# EAGLE design kitchenset19 (EAGLE 6.4)
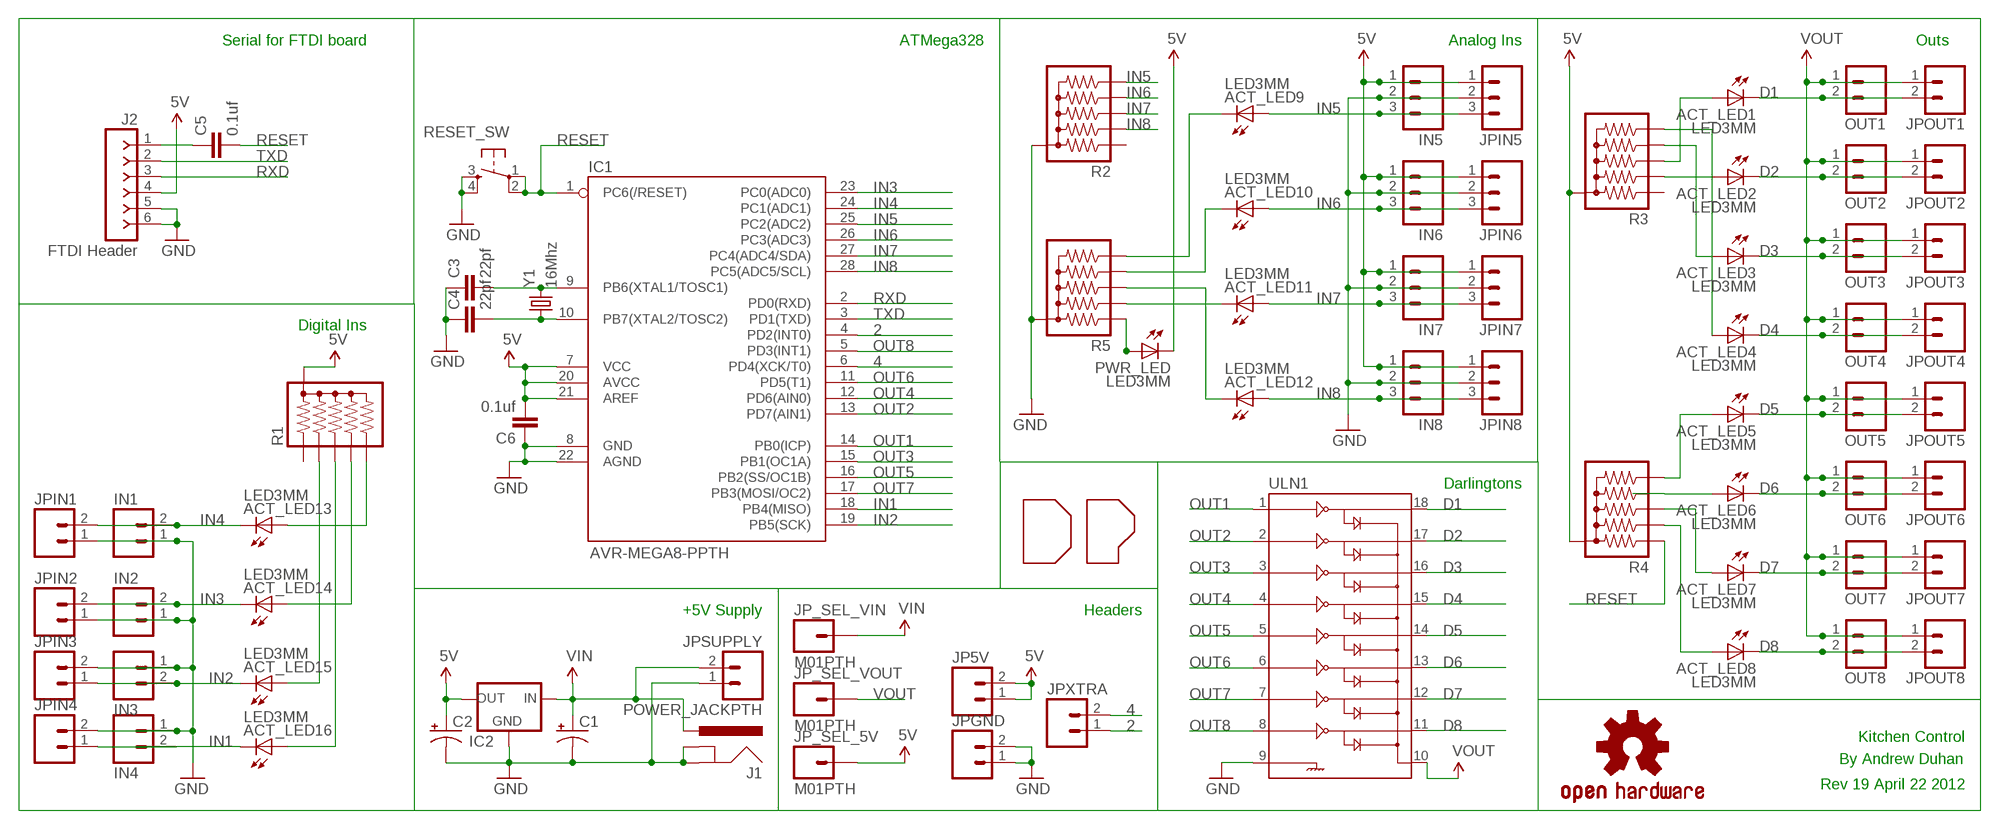
[diagram p0: schematic, sheet 1]

## Parts
ACT_LED1  LED3MM  [LED3MM-POL]
ACT_LED2  LED3MM  [LED3MM-POL]
ACT_LED3  LED3MM  [LED3MM-POL]
ACT_LED4  LED3MM  [LED3MM-POL]
ACT_LED5  LED3MM  [LED3MM-POL]
ACT_LED6  LED3MM  [LED3MM-POL]
ACT_LED7  LED3MM  [LED3MM-POL]
ACT_LED8  LED3MM  [LED3MM-POL]
ACT_LED9  LED3MM  [LED3MM-POL]
ACT_LED10  LED3MM  [LED3MM-POL]
ACT_LED11  LED3MM  [LED3MM-POL]
ACT_LED12  LED3MM  [LED3MM-POL]
ACT_LED13  LED3MM  [LED3MM-POL]
ACT_LED14  LED3MM  [LED3MM-POL]
ACT_LED15  LED3MM  [LED3MM-POL]
ACT_LED16  LED3MM  [LED3MM-POL]
C1  CAP_POLPTH4  [CPOL-RADIAL-1000UF-25V]
C2  CAP_POLPTH4  [CPOL-RADIAL-1000UF-25V]
C3  22pf  CAPPTH  [CAP-PTH-SMALL]
C4  22pf  CAPPTH  [CAP-PTH-SMALL]
C5  0.1uf  CAPPTH  [CAP-PTH-SMALL]
C6  0.1uf  CAPPTH  [CAP-PTH-SMALL]
IC1  AVR-MEGA8-PPTH  [DIL28-3]
IC2  V_REG_78XXSIDE  [78XXL]
IN1  M02JST-PTH-2  [JST-2-PTH]
IN2  M02JST-PTH-2  [JST-2-PTH]
IN3  M02JST-PTH-2  [JST-2-PTH]
IN4  M02JST-PTH-2  [JST-2-PTH]
IN5  M03JST-PTH  [JST-3-PTH]
IN6  M03JST-PTH  [JST-3-PTH]
IN7  M03JST-PTH  [JST-3-PTH]
IN8  M03JST-PTH  [JST-3-PTH]
J1  POWER_JACKPTH  [POWER_JACK_PTH]
J2  FTDI Header  F-1X06-SIP-100-32Y  [SIP-100-06-32Y]
JP5V  M02PTH  [1X02]
JP_SEL_5V  M01PTH  [1X01]
JP_SEL_VIN  M01PTH  [1X01]
JP_SEL_VOUT  M01PTH  [1X01]
JPGND  M02PTH  [1X02]
JPIN1  M02PTH  [1X02]
JPIN2  M02PTH  [1X02]
JPIN3  M02PTH  [1X02]
JPIN4  M02PTH  [1X02]
JPIN5  M03PTH  [1X03]
JPIN6  M03PTH  [1X03]
JPIN7  M03PTH  [1X03]
JPIN8  M03PTH  [1X03]
JPOUT1  M02PTH  [1X02]
JPOUT2  M02PTH  [1X02]
JPOUT3  M02PTH  [1X02]
JPOUT4  M02PTH  [1X02]
JPOUT5  M02PTH  [1X02]
JPOUT6  M02PTH  [1X02]
JPOUT7  M02PTH  [1X02]
JPOUT8  M02PTH  [1X02]
JPSUPPLY  M02PTH4  [1X02_XTRA_BIG]
JPXTRA  M02PTH  [1X02]
OUT1  M02JST-PTH-2  [JST-2-PTH]
OUT2  M02JST-PTH-2  [JST-2-PTH]
OUT3  M02JST-PTH-2  [JST-2-PTH]
OUT4  M02JST-PTH-2  [JST-2-PTH]
OUT5  M02JST-PTH-2  [JST-2-PTH]
OUT6  M02JST-PTH-2  [JST-2-PTH]
OUT7  M02JST-PTH-2  [JST-2-PTH]
OUT8  M02JST-PTH-2  [JST-2-PTH]
PWR_LED  LED3MM  [LED3MM-POL]
R1  RPACK-BUSSED-SIP-PTH-5  [RPACK-SIP-PTH-5]
R2  RPACK-BUSSED-SIP-PTH-5  [RPACK-SIP-PTH-5]
R3  RPACK-BUSSED-SIP-PTH-5  [RPACK-SIP-PTH-5]
R4  RPACK-BUSSED-SIP-PTH-5  [RPACK-SIP-PTH-5]
R5  RPACK-BUSSED-SIP-PTH-5  [RPACK-SIP-PTH-5]
RESET_SW  TAC_SWITCHPTH  [TACTILE-PTH]
U$1  OSHW-LOGOM  [OSHW-LOGO-M]
U$9  DP_LOGO  [DP_LOGO]
ULN1  ULN2803DIP  [DIL18]
Y1  16Mhz  CRYSTALHC49US  [HC49US]

## Nets
2: IC1.4(PD2(INT0)) JPXTRA.1
4: IC1.6(PD4(XCK/T0)) JPXTRA.2
5V: C2.1(+) C6.2 IC1.7(VCC) IC1.20(AVCC) IC1.21(AREF) IC2.OUT IN5.1 IN6.1 IN7.1 IN8.1 J2.4 JP5V.1 JP5V.2 JP_SEL_5V.1 JPIN5.1 JPIN6.1 JPIN7.1 JPIN8.1 PWR_LED.K(C) R1.P$1 R3.P$1 R4.P$1
D1: ACT_LED1.K(C) JPOUT1.2 OUT1.2 ULN1.18
D2: ACT_LED2.K(C) JPOUT2.2 OUT2.2 ULN1.17
D3: ACT_LED3.K(C) JPOUT3.2 OUT3.2 ULN1.16
D4: ACT_LED4.K(C) JPOUT4.2 OUT4.2 ULN1.15
D5: ACT_LED5.K(C) JPOUT5.2 OUT5.2 ULN1.14
D6: ACT_LED6.K(C) JPOUT6.2 OUT6.2 ULN1.13
D7: ACT_LED7.K(C) JPOUT7.2 OUT7.2 ULN1.12
D8: ACT_LED8.K(C) JPOUT8.2 OUT8.2 ULN1.11
DTR: C5.1 J2.1
GND: C1.2(-) C2.2(-) C3.1 C4.1 C6.1 IC1.8(GND) IC1.22(AGND) IC2.GND IN1.1 IN2.1 IN3.1 IN4.1 IN5.2 IN6.2 IN7.2 IN8.2 J1.GND J1.GNDBREAK J2.5 J2.6 JPGND.1 JPGND.2 JPIN1.1 JPIN2.1 JPIN3.2 JPIN4.2 JPIN5.2 JPIN6.2 JPIN7.2 JPIN8.2 JPSUPPLY.1 R2.P$1 R5.P$1 RESET_SW.3 RESET_SW.4 ULN1.9
IN1: ACT_LED16.K(C) IC1.18(PB4(MISO)) IN4.2 JPIN4.1
IN2: ACT_LED15.K(C) IC1.19(PB5(SCK)) IN3.2 JPIN3.1
IN3: ACT_LED14.K(C) IC1.23(PC0(ADC0)) IN2.2 JPIN2.2
IN4: ACT_LED13.K(C) IC1.24(PC1(ADC1)) IN1.2 JPIN1.2
IN5: ACT_LED9.A IC1.25(PC2(ADC2)) IN5.3 JPIN5.3 R2.P$6
IN6: ACT_LED10.A IC1.26(PC3(ADC3)) IN6.3 JPIN6.3 R2.P$5
IN7: ACT_LED11.A IC1.27(PC4(ADC4/SDA)) IN7.3 JPIN7.3 R2.P$4
IN8: ACT_LED12.A IC1.28(PC5(ADC5/SCL)) IN8.3 JPIN8.3 R2.P$3
N$1: ACT_LED9.K(C) R5.P$6
N$2: ACT_LED4.A R3.P$6
N$3: ACT_LED13.A R1.P$6
N$4: C4.2 IC1.10(PB7(XTAL2/TOSC2)) Y1.1
N$5: C3.2 IC1.9(PB6(XTAL1/TOSC1)) Y1.2
N$6: ACT_LED3.A R3.P$5
N$7: ACT_LED2.A R3.P$3
N$8: ACT_LED1.A R3.P$4
N$32: ACT_LED6.A R4.P$5
N$33: ACT_LED8.A R4.P$3
N$34: ACT_LED7.A R4.P$4
N$35: ACT_LED5.A R4.P$6
N$37: ACT_LED14.A R1.P$5
N$38: ACT_LED16.A R1.P$4
N$39: ACT_LED10.K(C) R5.P$5
N$41: ACT_LED12.K(C) R5.P$4
N$42: ACT_LED11.K(C) R5.P$3
N$44: PWR_LED.A R5.P$2
N$45: ACT_LED15.A R1.P$3
OUT1: IC1.14(PB0(ICP)) ULN1.1
OUT2: IC1.13(PD7(AIN1)) ULN1.2
OUT3: IC1.15(PB1(OC1A)) ULN1.3
OUT4: IC1.12(PD6(AIN0)) ULN1.4
OUT5: IC1.16(PB2(SS/OC1B)) ULN1.5
OUT6: IC1.11(PD5(T1)) ULN1.6
OUT7: IC1.17(PB3(MOSI/OC2)) ULN1.7
OUT8: IC1.5(PD3(INT1)) ULN1.8
RESET: C5.2 IC1.1(PC6(/RESET)) R4.P$2 RESET_SW.1 RESET_SW.2
RXD: IC1.2(PD0(RXD)) J2.3
TXD: IC1.3(PD1(TXD)) J2.2
VIN: C1.1(+) IC2.IN J1.PWR JP_SEL_VIN.1 JPSUPPLY.2
VOUT: JP_SEL_VOUT.1 JPOUT1.1 JPOUT2.1 JPOUT3.1 JPOUT4.1 JPOUT5.1 JPOUT6.1 JPOUT7.1 JPOUT8.1 OUT1.1 OUT2.1 OUT3.1 OUT4.1 OUT5.1 OUT6.1 OUT7.1 OUT8.1 ULN1.10
Unconnected: R1.P$2 R2.P$2 R3.P$2

## Notes on the sheet
- Serial for FTDI board | ATMega328 | Analog Ins | Outs
- Digital Ins
- Darlingtons
- +5V Supply | Headers
- Kitchen Control
- By Andrew Duhan
- Rev 19 April 22 2012

## Library data of the parts
ACT_LED1-ACT_LED16 PWR_LED = myparts:LED3MM
C1 C2 = SparkFun-Passives:CAP_POL: Capacitor Polarized These are standard SMD and PTH capacitors. Normally 10uF, 47uF, and 100uF in electrolytic and tantalum varieties. Always verify the external diameter of the through hole cap, it varies with capacity, voltage, and manufacturer. The EIA devices should be standard.
C3-C6 = SparkFun:CAP: Capacitor Standard 0603 ceramic capacitor, and 0.1" leaded capacitor.
IC1 = SparkFun:AVR-MEGA8-P: MICROCONTROLLER 8 Kbytes FLASH 1 kbytes SRAM 512 bytes EEPROM USART 4-channel 10 bit ADC 2-channel 8 bit ADC
IC2 = SparkFun-PowerIC:V_REG_78XX: Voltage Regulator Standard 7805 5V regulator. IGO (Input Ground Output). Spark Fun Electronics SKU : COM-00107
IN1 IN2 JPIN1-JPIN4 JPOUT1-JPOUT8 = SparkFun-Connectors:M02: Header 2 Standard 2-pin 0.1" header. Use with straight break away headers (SKU : PRT-00116), right angle break away headers (PRT-00553), swiss pins (PRT-00743), machine pins (PRT-00117), and female headers (PRT-00115). Molex polarized connector foot print use with SKU : PRT-08233 with associated crimp pins and housings.
IN3 IN4 JP5V JPGND JPSUPPLY JPXTRA OUT1-OUT8 = SparkFun:M02: Header 2 Standard 2-pin 0.1" header. Use with straight break away headers (SKU : PRT-00116), right angle break away headers (PRT-00553), swiss pins (PRT-00743), machine pins (PRT-00117), and female headers (PRT-00115). Molex polarized connector foot print use with SKU : PRT-08233 with associated crimp pins and housings.
IN5-IN8 = SparkFun:M03: Header 3 Standard 3-pin 0.1" header. Use with straight break away headers (SKU : PRT-00116), right angle break away headers (PRT-00553), swiss pins (PRT-00743), machine pins (PRT-00117), and female headers (PRT-00115). Molex polarized connector foot print use with SKU : PRT-08232 with associated crimp pins and housings.
J1 = SparkFun:POWER_JACK: Power Jack This is the standard 5.5mm barrel jack for power. The PTH is the most common, proven, reliable, footprint. All others are experimental. The Slot footprint only works if the mill layer is transmitted to the PCB fab house so be warned. Spark Fun Electronics SKU : PRT-00119. Mating wall wart : TOL-00298 (and others)
J2 = con-headers-jp:F-1X06-: FEMALE HEADER
JP_SEL_5V JP_SEL_VIN JP_SEL_VOUT = SparkFun:M01: Header 1 Standard 1-pin 0.1" header. Use with straight break away headers (SKU : PRT-00116), right angle break away headers (PRT-00553), swiss pins (PRT-00743), machine pins (PRT-00117), and female headers (PRT-00115).
JPIN5-JPIN8 = SparkFun-Connectors:M03: Header 3 Standard 3-pin 0.1" header. Use with straight break away headers (SKU : PRT-00116), right angle break away headers (PRT-00553), swiss pins (PRT-00743), machine pins (PRT-00117), and female headers (PRT-00115). Molex polarized connector foot print use with SKU : PRT-08232 with associated crimp pins and housings.
R1-R5 = SparkFun:RPACK*: BOURNS 4600X series thick-film SIP resistor packs Five resistors bussed to a single pin (denoted by dot). 0.2W / resistor datasheet <http://dlnmh9ip6v2uc.cloudfront.net/datasheets/Components/General/4600x.pdf> SFE parts COM-10855 (330), COM-10856 (10K)
RESET_SW = SparkFun:TAC_SWITCH: Momentary Switch Button commonly used for reset or general input. Spark Fun Electronics SKU : COM-00097
U$1 = SparkFun-Aesthetics:OSHW-LOGO: Open Source Hardware Logo This logo indicates the piece of hardware it is found on incorporates a OSHW license and/or adheres to the definition of open source hardware found here: http://freedomdefined.org/OSHW
U$9 = myparts:DP_LOGO: Duhan Power! logo
ULN1 = SparkFun:ULN2803: Darlington Driver ULN2803 Darlington array. 500mA max per channel, 8-channel package. Spark Fun Electronics SKU : COM-00312
Y1 = SparkFun:CRYSTAL: Crystals Various standard crystals. Proven footprints. Spark Fun Electronics SKU : COM-00534

## Board
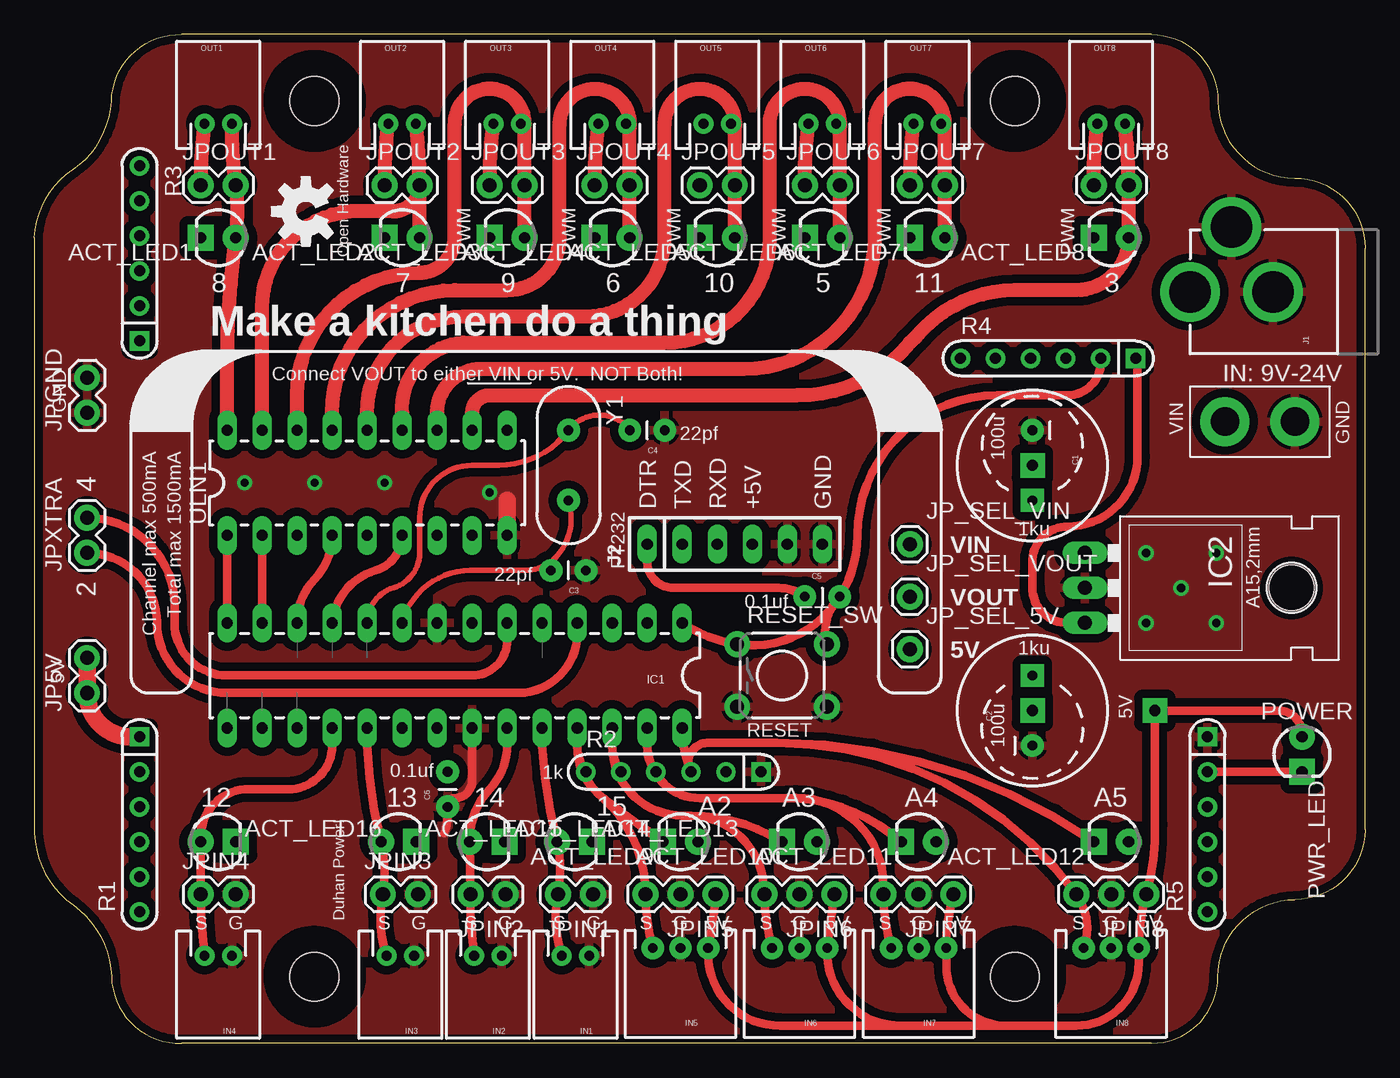
[diagram p1: board, top side]
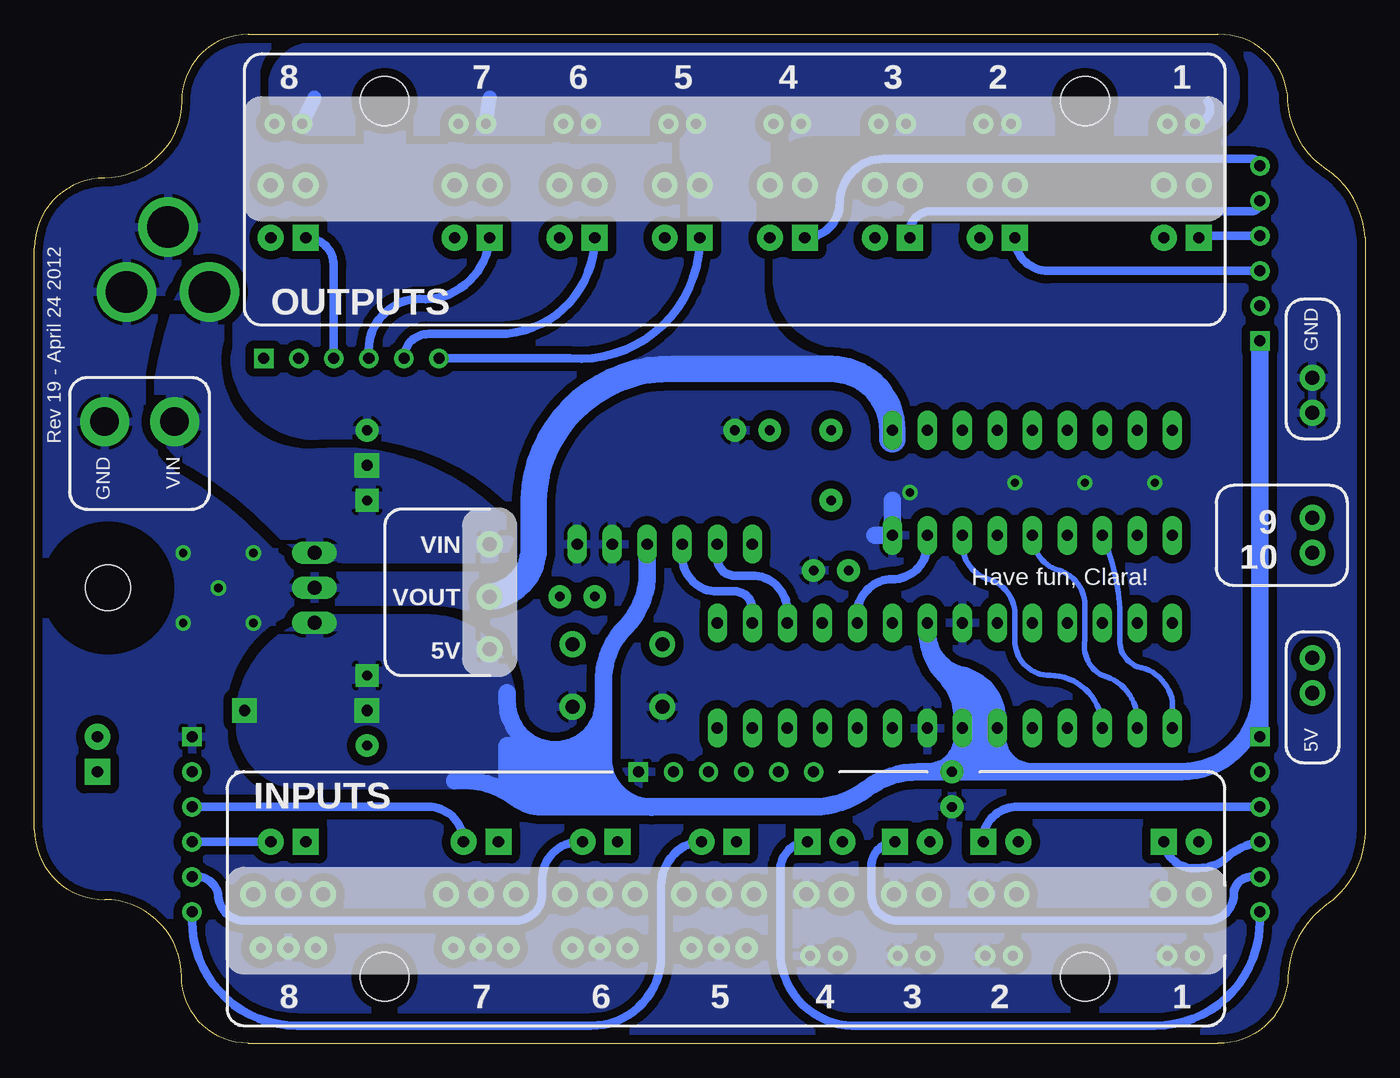
[diagram p2: board, bottom side, seen from below]

Size 96.52 x 73.15 mm. Coordinates in mm from the lower left corner, seen from the top.
Outline: 96.52,15.49 96.52,57.66 arc90 91.44,62.74 arc-90 85.85,68.33 arc90 81.03,73.15 10.67,73.15 arc90 5.59,68.33 arc-53 2.79,63.37 arc53 0,58.42 0,15.24 arc53 2.79,10.03 arc-53 5.59,4.83 arc90 10.67,0 81.03,0 arc90 85.85,4.83 arc-90 91.44,10.41 arc90 96.52,15.49
Copper layers (1*16): Top 0.035mm / dielectric 1.5mm / Bottom 0.035mm
Design rules "default": minimum track width 8mil, minimum drill 20mil, track to track 8mil, track to pad 8mil, pad to pad 8mil, via to via 8mil, smd to smd 8mil, copper to edge 10mil, drill to drill 8mil, minimum pad ring 12mil, minimum via ring 10mil, stop-mask expansion 4mil, vias tented up to drill 25mil, thermal gap 10mil
Holes 3.56 mm at 20.32,4.83 71.12,4.83 71.12,68.33 20.32,68.33
tRestrict: area 17.5,65.5 to 23.1,71.1; area 68.3,65.5 to 73.9,71.1; area 68.3,2 to 73.9,7.6; area 17.5,2 to 23.1,7.6

### Footprints (pad centres in the part's own frame; a part is rotated, then mirrored left to right if it is on the bottom)
LED3MM-POL = drill 0.813 pad 1.88 square: A 1.27,0 | drill 0.813 pad 1.88: K -1.27,0
CPOL-RADIAL-1000UF-25V = drill 0.7 pad 1.651 square: 1 2.54,0 | drill 0.7 pad 1.651: 2 -2.54,0
CAP-PTH-SMALL = drill 0.7 pad 1.651: 1 0,0; 2 2.54,0
DIL28-3 = drill 0.813 long: 1 -16.51,-3.81; 2 -13.97,-3.81; 3 -11.43,-3.81; 4 -8.89,-3.81; 5 -6.35,-3.81; 6 -3.81,-3.81; 7 -1.27,-3.81; 8 1.27,-3.81; 9 3.81,-3.81; 10 6.35,-3.81; 11 8.89,-3.81; 12 11.43,-3.81; 13 13.97,-3.81; 14 16.51,-3.81; 15 16.51,3.81; 16 13.97,3.81; 17 11.43,3.81; 18 8.89,3.81; 19 6.35,3.81; 20 3.81,3.81; 21 1.27,3.81; 22 -1.27,3.81; 23 -3.81,3.81; 24 -6.35,3.81; 25 -8.89,3.81; 26 -11.43,3.81; 27 -13.97,3.81; 28 -16.51,3.81
78XXL = drill 1.016 long: GND 0,-3.81; IN -2.54,-3.81; OUT 2.54,-3.81 | hole 3.302: 0,11.176
JST-2-PTH = drill 0.7 pad 1.448: 1 -1,0; 2 1,0
JST-3-PTH = drill 0.7 pad 1.626: 1 -2,-5; 2 0,-5; 3 2,-5
POWER_JACK_PTH = drill 2.997 pad 4.318: GND 0,7.7; GNDBREAK 4.7,10.7; PWR 0,13.7
SIP-100-06-32Y = drill 0.813 long: 1 -6.35,0; 2 -3.81,0; 3 -1.27,0; 4 1.27,0; 5 3.81,0; 6 6.35,0
1X02 = drill 1.016 pad 1.88: 1 0,0; 2 2.54,0
1X01 = drill 1.016 pad 1.88: 1 0,0
1X03 = drill 1.016 pad 1.88: 1 0,0; 2 2.54,0; 3 5.08,0
1X02_XTRA_BIG = drill 2.057 pad 3.556: 1 -2.54,0; 2 2.54,0
RPACK-SIP-PTH-5 = drill 0.8 square: P$1 0,0 | drill 0.8: P$2 0,-2.54; P$3 0,-5.08; P$4 0,-7.62; P$5 0,-10.16; P$6 0,-12.7
TACTILE-PTH = drill 1.016 pad 1.88: 1 -3.251,2.261; 2 3.251,2.261; 3 -3.251,-2.261; 4 3.251,-2.261
DIL18 = drill 0.813 long: 1 -10.16,-3.81; 2 -7.62,-3.81; 3 -5.08,-3.81; 4 -2.54,-3.81; 5 0,-3.81; 6 2.54,-3.81; 7 5.08,-3.81; 8 7.62,-3.81; 9 10.16,-3.81; 10 10.16,3.81; 11 7.62,3.81; 12 5.08,3.81; 13 2.54,3.81; 14 0,3.81; 15 -2.54,3.81; 16 -5.08,3.81; 17 -7.62,3.81; 18 -10.16,3.81
HC49US = drill 0.7 pad 1.651: 1 -2.54,0; 2 2.54,0

### Placement (x,y rotation side)
ACT_LED1  13.34,58.42 180 top
ACT_LED2  26.67,58.42 180 top
ACT_LED3  34.29,58.42 180 top
ACT_LED4  41.91,58.42 180 top
ACT_LED5  49.53,58.42 180 top
ACT_LED6  57.15,58.42 180 top
ACT_LED7  64.77,58.42 180 top
ACT_LED8  78.11,58.42 180 top
ACT_LED9  46.86,14.61 180 top
ACT_LED10  55.5,14.61 180 top
ACT_LED11  64.14,14.61 180 top
ACT_LED12  78.11,14.61 180 top
ACT_LED13  39.18,14.61 0 top
ACT_LED14  32.83,14.61 0 top
ACT_LED15  26.42,14.61 0 top
ACT_LED16  13.34,14.61 0 top
C1  72.39,41.91 270 top
C2  72.39,24.13 90 top
C3  40.01,34.29 180 top
C4  45.72,44.45 180 top
C5  55.88,32.38 0 top
C6  29.97,17.14 90 top
IC1  30.48,26.67 180 top
IC2  80.01,33.02 270 top
IN1  39.24,6.35 180 top
IN2  32.89,6.35 180 top
IN3  26.54,6.35 180 top
IN4  13.34,6.35 180 top
IN5  46.86,1.91 180 top
IN6  55.5,1.91 180 top
IN7  64.14,1.91 180 top
IN8  78.11,1.91 180 top
J1  97.54,54.48 90 top
J2  50.8,36.2 0 top
JP5V  3.81,25.4 90 top
JP_SEL_5V  63.5,28.57 0 top
JP_SEL_VIN  63.5,36.2 0 top
JP_SEL_VOUT  63.5,32.38 0 top
JPGND  3.81,45.72 90 top
JPIN1  40.51,10.79 180 top
JPIN2  34.16,10.79 180 top
JPIN3  25.27,10.79 0 top
JPIN4  12.06,10.79 0 top
JPIN5  49.4,10.79 180 top
JPIN6  58.04,10.79 180 top
JPIN7  66.67,10.79 180 top
JPIN8  80.64,10.79 180 top
JPOUT1  12.06,62.23 0 top
JPOUT2  25.4,62.23 0 top
JPOUT3  33.02,62.23 0 top
JPOUT4  40.64,62.23 0 top
JPOUT5  48.26,62.23 0 top
JPOUT6  55.88,62.23 0 top
JPOUT7  63.5,62.23 0 top
JPOUT8  76.83,62.23 0 top
JPSUPPLY  88.9,45.09 180 top
JPXTRA  3.81,35.56 90 top
OUT1  13.34,66.67 0 top
OUT2  26.67,66.67 0 top
OUT3  34.29,66.67 0 top
OUT4  41.91,66.67 0 top
OUT5  49.53,66.67 0 top
OUT6  57.15,66.67 0 top
OUT7  64.77,66.67 0 top
OUT8  78.11,66.67 0 top
PWR_LED  91.95,20.95 270 top
R1  7.62,22.23 0 top
R2  52.7,19.68 270 top
R3  7.62,50.93 180 top
R4  79.88,49.66 270 top
R5  85.09,22.23 0 top
RESET_SW  54.23,26.67 0 top
U$1  19.68,60.33 90 top
U$9  19.05,12.7 90 top
ULN1  24.13,40.64 0 top
Y1  38.73,41.91 270 top

### Tracks (layer width: path | path; a pad name or v marks a point on that pad's centre or on a via)
2
  Top 0.61: IC1.4 arc-90 35.56,25.4 13.97,25.4 arc-90 8.89,30.48 arc90 JPXTRA.1
4
  Top 0.61: IC1.6 34.29,29.21 arc-90 31.75,26.67 13.97,26.67 arc-90 10.16,30.48 10.16,31.75 arc90 JPXTRA.2
5V  (via drill 0.8 pad 1.78)
  Top 0.61: 62.87,1.27 54.1,1.27 arc-95 IN5.1 arc9 JPIN5.1 | 70.48,1.27 arc-90 66.14,5.62 IN7.1 arc-16 JPIN7.1 | 70.48,1.27 62.87,1.27 | 62.87,1.27 arc-93 IN6.1 arc-2 JPIN6.1 | 70.48,1.27 75.56,1.27 arc90 80.11,5.81 IN8.1 arc-16 JPIN8.1 arc17 81.28,15.88 v81.28,24.13 90.17,24.13 arc-98 PWR_LED.K | IC2.OUT 74.93,30.48 arc-90 72.39,33.02 72.39,34.35 arc3 72.39,34.86 arc-91 74.93,37.47 arc90 80.01,42.55 80.01,49.53 arc90 R4.P$1
  Top 1.27: JP5V.2 JP5V.1 arc90 6.99,22.23 R1.P$1
  Bottom 1.27: 31.75,19.68 32.38,19.68 arc-37 36.2,18.41 arc37 40.01,17.14 51.44,17.14 | 27.94,19.68 C6.2 31.75,19.68 | 27.94,19.68 24.13,19.68 | 24.13,19.68 13.34,19.68 arc-90 7.62,25.4 | R1.P$1 7.62,25.4 | 7.62,25.4 R3.P$1 | 31.75,19.68 arc-90 29.21,22.23 IC1.21 29.21,23.5 arc-44 30.48,26.67 arc44 31.75,29.84 | 24.13,19.68 arc90 26.67,22.23 IC1.20 26.67,23.5 arc-77 29.21,26.67 | 29.21,26.67 arc77 31.75,29.84 | 31.75,29.84 IC1.7 | 27.3,25.4 27.3,20.32 arc90 27.94,19.68 | 28.57,20.32 28.57,26.04 arc-90 29.21,26.67 | 55.24,24.77 55.24,25.4 arc6 55.24,26.04 arc41 53.98,29.84 arc-44 52.07,33.66 J2.4 | 51.44,17.14 59.69,17.14 arc37 61.59,17.78 | 62.23,25.4 62.23,24.77 arc-180 55.24,24.77 | 61.59,17.78 arc-42 66.04,19.05 | 51.44,17.14 arc90 55.24,20.32 | 55.24,20.32 55.24,24.77 | 53.98,17.78 61.59,17.78 | 55.24,21.59 55.88,21.59 | 55.88,21.59 57.15,21.59 | 60.33,21.59 62.23,21.59 62.23,20.32 | 55.24,20.32 55.88,20.32 | 55.88,20.32 62.23,20.32 | 55.24,19.05 62.23,19.05 62.23,20.32 | 55.88,20.32 55.88,21.59
  other vias: 72.39,24.13
  pour Bottom (isolate 0.61): 74.93,30.48 67.94,30.48 arc90 62.23,24.77 62.23,20.95 arc90 64.14,19.05 76.83,19.05 arc90 81.28,22.86 arc90
D1
  Top 1.016: ULN1.18 13.97,48.26 arc-8 ACT_LED1.K arc15 JPOUT1.2 arc-8 OUT1.2
D2
  Top 1.016: JPOUT2.2 arc7 OUT2.2 | JPOUT2.2 arc-90 26.04,60.33 22.86,60.33 arc85 16.51,53.34 ULN1.17 | ACT_LED2.K JPOUT2.2
D3
  Top 1.016: ULN1.16 19.05,46.99 arc-90 27.94,55.88 arc90 30.48,58.42 30.48,66.67 arc-180 35.56,66.67 | 35.56,66.67 JPOUT3.2 ACT_LED3.K | OUT3.2 35.56,66.67
D4
  Top 1.016: ULN1.15 21.59,45.72 arc-90 30.48,54.61 34.29,54.61 arc90 38.1,58.42 38.1,66.67 arc-180 43.18,66.67 43.18,66.41 | 43.18,66.41 JPOUT4.2 ACT_LED4.K | 43.18,66.41 OUT4.2
D5
  Top 1.016: 50.8,66.41 JPOUT5.2 ACT_LED5.K | 50.8,66.41 OUT5.2 | ULN1.14 24.13,45.72 arc-90 31.11,52.7 40.01,52.7 arc90 45.72,58.42 45.72,66.67 arc-180 50.8,66.67 50.8,66.41
D6
  Top 1.016: ULN1.13 26.67,45.72 arc-90 31.11,50.8 45.72,50.8 arc90 53.34,58.42 53.34,66.67 arc-180 58.42,66.67 58.42,66.41 | 58.42,66.41 JPOUT6.2 ACT_LED6.K | 58.42,66.41 OUT6.2
D7
  Top 1.016: ULN1.12 29.21,45.72 arc-90 32.38,48.9 51.44,48.9 arc90 60.96,58.42 60.96,66.67 arc-180 66.04,66.67 | 66.04,66.67 JPOUT7.2 ACT_LED7.K | OUT7.2 66.04,66.67
D8
  Top 1.016: ULN1.11 31.75,45.72 arc-90 33.02,46.99 55.24,46.99 arc53 63.5,50.8 arc8 64.14,51.44 arc-49 71.12,54.61 75.56,54.61 arc90 ACT_LED8.K JPOUT8.2 arc7 OUT8.2
DTR
  Top 0.61: J2.1 44.45,34.92 arc90 46.35,33.02 53.98,33.02 arc-37 C5.1
GND  (via drill 0.6)
  Top 0.61: 29.72,15.24 arc23 29.97,16.76 29.97,17.27 arc-90 30.48,17.78 arc90 31.75,19.05 IC1.22
  Top 1.27: ULN1.9 34.29,39.37
  Bottom 1.27: 35.56,36.83 ULN1.9 34.29,39.37
  other vias: 80.64,35.56 85.72,35.56 80.64,30.48 85.72,30.48 83.19,33.02 15.24,40.64 20.32,40.64 33.02,39.94 25.4,40.64
  pour Top (isolate 0.61, rank 2): 0,73.66 0,0 96.52,0 96.52,73.66
  pour Bottom (isolate 0.61, rank 2): 0,0 96.52,0 96.52,73.66 0,73.66
IN1
  Top 0.61: IN4.2 arc-7 JPIN4.1 ACT_LED16.K arc-90 15.24,18.41 18.41,18.41 arc90 21.59,21.59 IC1.18
IN2
  Top 0.61: IC1.19 24.13,21.59 arc11 ACT_LED15.K arc-23 JPIN3.1 arc30 IN3.2
IN3
  Top 0.61: IN2.2 arc-7 JPIN2.2 ACT_LED14.K arc-44 33.02,18.41 arc42 34.29,21.59 IC1.23
IN4
  Top 0.61: IC1.24 36.83,21.59 arc11 ACT_LED13.K arc-23 JPIN1.2 arc30 IN1.2
IN5
  Top 0.61: 39.37,21.59 arc53 41.27,17.78 | IN5.3 arc-16 JPIN5.3 arc47 41.27,17.78 | IC1.25 39.37,21.59 | 39.37,21.59 arc37 R2.P$6 | 41.27,17.78 arc4 ACT_LED9.A
IN6
  Top 0.61: 47.62,16.51 46.99,16.51 arc-90 41.91,21.59 | IN6.3 arc-16 JPIN6.3 arc6 52.83,11.94 arc79 47.62,16.51 | IC1.26 41.91,21.59 | 41.91,21.59 arc37 R2.P$5 | 47.62,16.51 arc-32 ACT_LED10.A
IN7
  Top 0.61: 54.61,17.78 48.26,17.78 arc-90 44.45,21.59 | IN7.3 arc-16 JPIN7.3 61.59,11.43 arc95 54.61,17.78 | IC1.27 44.45,21.59 | 44.45,21.59 arc37 R2.P$4 | 54.61,17.78 arc-42 ACT_LED11.A
IN8
  Top 0.61: IC1.28 arc23 R2.P$3 arc-118 48.77,21.78 53.85,21.78 | IN8.3 arc57 JPIN8.3 arc54 53.85,21.78 | 53.85,21.78 arc-35 ACT_LED12.A
N$1
  Bottom 0.61: R5.P$6 85.09,8.89 arc-90 77.47,1.27 56.13,1.27 arc-90 51.05,6.35 51.05,11.43 arc77 48.51,14.61 arc25 ACT_LED9.K
N$2
  Bottom 0.61: ACT_LED4.A arc-90 38.1,60.96 arc90 34.92,64.14 8.26,64.14 arc77 R3.P$6
N$3
  Bottom 0.61: R1.P$6 7.62,8.89 arc90 15.24,1.27 36.7,1.27 arc90 42.42,6.35 42.42,12.45 arc90 ACT_LED13.A
N$4
  Top 0.406: C4.2 arc106 Y1.1 arc-53 33.66,41.91 31.75,41.91 arc90 27.94,38.1 27.94,35.56 arc-74 26.04,33.02 arc74 IC1.10
N$5
  Top 0.406: 37.47,34.92 arc-37 35.56,34.29 31.62,34.29 arc75 IC1.9 | 37.47,34.92 arc16 38.1,35.56 arc55 Y1.2 | C3.2 37.47,34.92
N$6
  Bottom 0.61: ACT_LED3.A arc90 31.75,60.33 8.26,60.33 arc-100 R3.P$5
N$7
  Bottom 0.61: R3.P$3 22.99,56.01 arc90 ACT_LED2.A
N$8
  Bottom 0.61: R3.P$4 11.3,58.55 arc-19 ACT_LED1.A
N$32
  Bottom 0.61: ACT_LED6.A arc90 62.87,51.44 67.94,51.44 arc-90 R4.P$5
N$33
  Bottom 0.61: R4.P$3 74.8,56.39 arc-90 ACT_LED8.A
N$34
  Bottom 0.61: R4.P$4 72.26,50.29 arc90 68.58,53.98 arc-90 ACT_LED7.A
N$35
  Bottom 0.61: R4.P$6 57.66,49.66 arc-91 48.26,57.91 arc3 ACT_LED5.A
N$37
  Bottom 0.61: R1.P$5 8.26,12.06 arc-90 9.53,10.79 arc90 11.43,8.89 33.91,8.89 arc90 35.81,10.79 35.81,12.7 arc90 ACT_LED14.A
N$38
  Bottom 0.61: ACT_LED16.A arc-90 12.06,12.7 arc-37 10.16,13.34 arc37 R1.P$4
N$39
  Bottom 0.61: R5.P$5 arc90 83.19,10.79 arc-90 81.28,8.89 61.59,8.89 arc-90 59.69,10.79 59.69,11.94 arc93 ACT_LED10.K
N$41
  Bottom 0.61: R5.P$4 ACT_LED12.K
N$42
  Bottom 0.61: R5.P$3 67.94,17.14 arc90 ACT_LED11.K
N$44
  Top 0.61: R5.P$2 PWR_LED.A
N$45
  Bottom 0.61: R1.P$3 25.4,17.14 arc-90 ACT_LED15.A
OUT1
  Top 0.61: IC1.14 ULN1.1
OUT2
  Top 0.61: IC1.13 ULN1.2
OUT3
  Bottom 0.406: ULN1.3 arc25 17.78,30.48 arc-2 17.78,29.21 arc-71 16.51,27.3 arc71 13.97,24.77 arc2 IC1.15
OUT4
  Top 0.61: ULN1.4 arc-44 20.32,33.66 arc44 IC1.12
OUT5
  Bottom 0.406: ULN1.5 arc-74 22.23,34.29 arc74 20.32,31.75 20.32,29.21 arc-74 19.05,26.67 arc74 16.51,23.5 IC1.16
OUT6
  Top 0.61: ULN1.6 arc-74 24.77,34.29 arc68 IC1.11
OUT7
  Bottom 0.406: IC1.17 arc-90 22.86,26.67 arc90 25.4,29.21 25.4,31.11 arc-74 27.3,33.66 arc74 29.21,36.2 ULN1.7
OUT8
  Bottom 0.61: IC1.5 36.83,31.11 arc90 34.29,33.66 arc-90 31.75,36.2 ULN1.8
RESET
  Top 0.61: C5.2 arc32 59.69,36.83 arc-90 69.85,46.99 74.93,46.99 arc96 R4.P$2 | C5.2 arc-66 RESET_SW.1 arc-26 IC1.1 | C5.2 58.04,31.88 arc52 RESET_SW.2
RXD
  Bottom 0.61: IC1.2 44.45,31.5 arc-90 45.72,32.77 46.99,32.77 arc90 49.53,35.31 J2.3
TXD
  Bottom 0.61: IC1.3 41.91,31.37 arc-90 44.45,33.91 45.72,33.91 arc90 46.99,35.18 J2.2
VIN  (via drill 0.8 pad 1.78)
  other vias: 72.39,41.91
  pour Bottom: 63.37,35.43 74.04,35.43 arc47 78.74,37.47 arc-18 85.09,42.42 arc70 87.38,47.12 arc9 85.85,53.59 arc188 82.93,52.45 arc-121 75.95,42.55 arc49 63.37,38.23 arc146
VOUT
  Top 1.016: JPOUT2.1 arc-7 OUT2.1 | JPOUT3.1 arc-7 OUT3.1 | JPOUT4.1 arc-7 OUT4.1 | JPOUT6.1 arc-7 OUT6.1 | JPOUT1.1 arc-7 OUT1.1 | JPOUT7.1 arc-7 OUT7.1 | JPOUT8.1 arc-7 OUT8.1
  Bottom 0.61: OUT1.1 11.94,66.8 arc-108 11.43,68.33
  Bottom 1.016: OUT7.1 63.5,68.58 | OUT8.1 76.2,68.58
  Bottom 1.93: JP_SEL_VOUT.1 arc-90 60.33,36.2 60.33,39.37 arc90 50.16,48.9 38.73,48.9 arc90 ULN1.10 34.29,43.81
  pour Bottom (isolate 0.61): 13.97,71.75 76.2,71.75 arc-90 78.74,69.22 arc-90 76.2,66.67 52.7,66.67 arc90 48.26,62.23 48.26,57.15 arc80 52.58,48.9 arc-159 52.07,48.9 38.1,48.9 arc90 44.45,54.61 44.45,62.23 arc90 40.01,66.67 12.06,66.67 arc-106 10.16,70.48 arc-70 12.06,71.75 arc-7

### Text on the board
tPlace: Open Hardware | PWM | PWM | PWM | PWM | PWM | PWM | 8 | 7 | 9 | 6 | 10 | 5 | 11 | 3 | Make a kitchen do a thing | GND | IN: 9V-24V | Connect VOUT to either VIN or 5V. NOT Both! | GND | VIN | 100u | 22pf | Channel max 500mA | Total max 1500mA | 4 | DTR | TXD | RXD | +5V | GND | 1ku | VIN | 22pf | FT232 | 0.1uf | 2 | VOUT | 1ku | 5V | 5V | 100u | 5V | RESET | POWER | 0.1uf | 1k | 12 | 13 | 14 | 15 | A2 | A3 | A4 | A5 | S | G | Duhan Power! | S | G | S | G | S | G | S | G | 5V | S | G | 5V | S | G | 5V | S | G | 5V
bPlace: 1 | 2 | 3 | 4 | 5 | 6 | 7 | 8 | Rev 19 - April 24 2012 | GND | OUTPUTS | VIN | GND | 9 | VIN | 10 | Have fun, Clara! | VOUT | 5V | 5V | INPUTS | 1 | 2 | 3 | 4 | 5 | 6 | 7 | 8